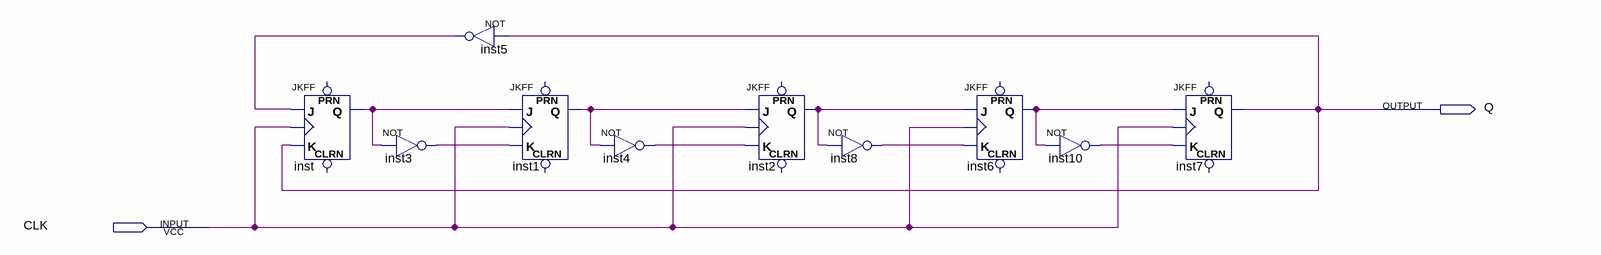
[diagram p0: schematic sheet]
// Quartus schematic 10bunshu.bdf as structural Verilog: 10 symbols, 2 pins
module \10bunshu  (
  input  CLK,
  output Q
);

  wire inst1_q, inst2_q, inst3_out, inst4_out, inst5_out, inst6_q, inst8_out, inst10_out, inst_q;

  JKFF inst (.K(Q), .J(inst5_out), .CLK(CLK), .Q(inst_q));  // open: PRN, CLRN
  not inst3 (inst3_out, inst_q);
  not inst5 (inst5_out, Q);
  JKFF inst1 (.K(inst3_out), .J(inst_q), .CLK(CLK), .Q(inst1_q));  // open: PRN, CLRN
  not inst4 (inst4_out, inst1_q);
  JKFF inst2 (.K(inst4_out), .J(inst1_q), .CLK(CLK), .Q(inst2_q));  // open: PRN, CLRN
  not inst8 (inst8_out, inst2_q);
  JKFF inst6 (.K(inst8_out), .J(inst2_q), .CLK(CLK), .Q(inst6_q));  // open: PRN, CLRN
  not inst10 (inst10_out, inst6_q);
  JKFF inst7 (.K(inst10_out), .J(inst6_q), .CLK(CLK), .Q(Q));  // open: PRN, CLRN
endmodule
